# Altium schematic sheet [08] - LUX, LED_BOARD CONN.SchDoc
size A4; DocumentNumber: 8; SheetNumber: 8; SheetTotal: 14
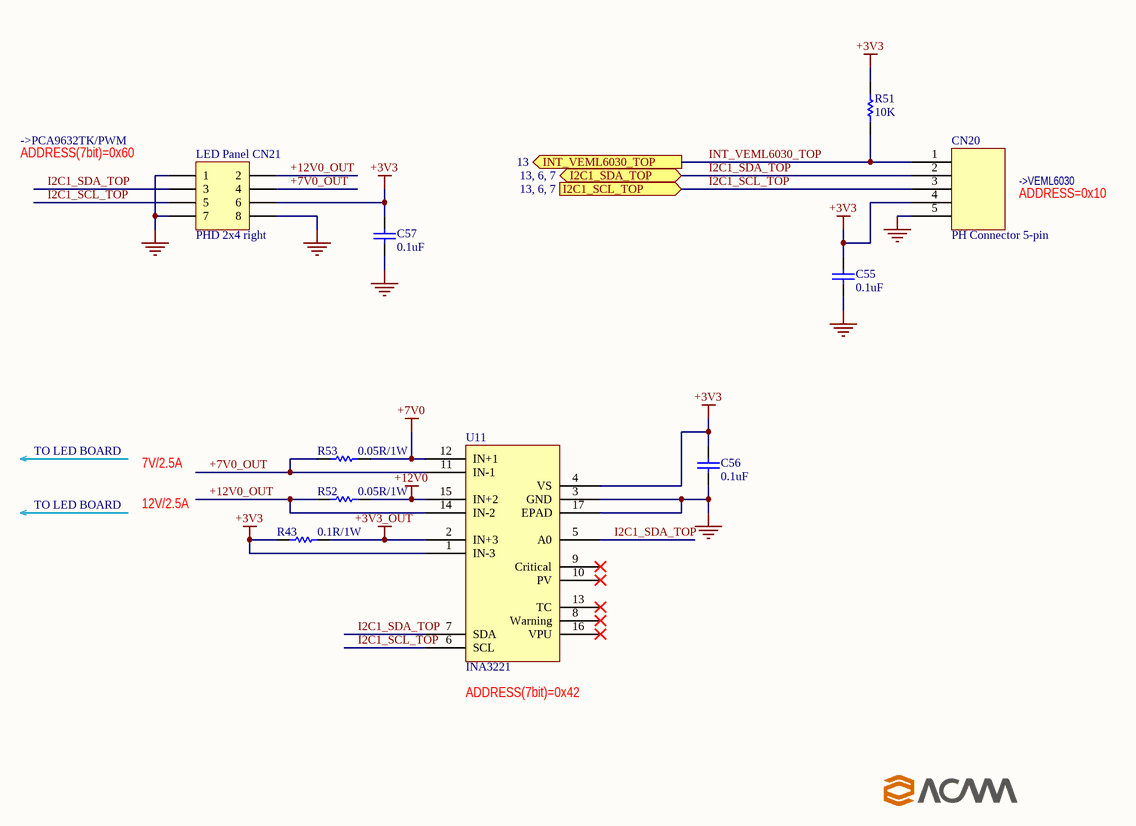
[diagram p0: [08] - LUX, LED_BOARD CONN.SchDoc]

## Parts
C55  0.1uF  [0805_C_AUTO]
C56  0.1uF  [0805_C_AUTO]
C57  0.1uF  [0805_C_AUTO]
CN20  PH Connector 5-pin  [PH_5PIN]
LED_Panel_CN21  PHD 2x4 right  [PHDR_8PIN]
R43  0.1R/1W  [2512_R]
R51  10K  [0805_R_AUTO]
R52  0.05R/1W  [2512_R]
R53  0.05R/1W  [2512_R]
U11  INA3221  [QFN-16]

## Ports
I2C1_SCL_TOP (in, see 13, 6, 7), I2C1_SDA_TOP (bidir, see 13, 6, 7), INT_VEML6030_TOP (out, see 13)

## Nets
+3V3: C55.2 C56.2 C57.2 CN20.4 LED_Panel_CN21.6 R43.1 R51.1 U11.1(IN-3) U11.4(VS)
+3V3_OUT: R43.2 U11.2(IN+3)
+7V0: R53.2 U11.12(IN+1)
+12V0: R52.2 U11.15(IN+2)
GND: C55.1 C56.1 C57.1 CN20.5 LED_Panel_CN21.1 LED_Panel_CN21.7 LED_Panel_CN21.8 U11.3(GND) U11.17(EPAD)
+7V0_OUT: LED_Panel_CN21.4 R53.1 U11.11(IN-1)
+12V0_OUT: LED_Panel_CN21.2 R52.1 U11.14(IN-2)
I2C1_SCL_TOP: CN20.3 LED_Panel_CN21.5 U11.6(SCL) ; port I2C1_SCL_TOP
I2C1_SDA_TOP: CN20.2 LED_Panel_CN21.3 U11.5(A0) U11.7(SDA) ; port I2C1_SDA_TOP
INT_VEML6030_TOP: CN20.1 R51.2 ; port INT_VEML6030_TOP

Not connected (* = marked no-connect by the designer): U11 8(Warning)* 9(Critical)* 10(PV)* 13(TC)* 16(VPU)*

## Notes on the sheet
- (near LED_Panel_CN21) ADDRESS(7bit)=0x60
- ->PCA9632TK/PWM
- ->VEML6030
- ADDRESS=0x10
- TO LED BOARD
- 12V/2.5A
- 7V/2.5A
- (near U11) ADDRESS(7bit)=0x42

## Library data of the parts
C55-C57 = Cap SMD: Non-Pol SMD Capacitor; RATED_VOLTAGE: 16V; Value: 0.1uF; Manufacturer Part Num: *
CN20 = PH Connector 5-pin: PH Connector , 5 pin, 2mm pitch, straight; Value: PH Connector 5-pin
LED_Panel_CN21 = PHD Connector 2x4 Right: S8B-PHDSS, PH Double Right 2x4; Value: PHD 2x4 right
R43 = Res SMD: SMD Resistor; Manufacturer Part Num: RL2512FK-070R1L; Tolerance: 1%; Value: 0.1R/1W
R51 = Res SMD: SMD Resistor; Tolerance: 5%; Value: 10K; Manufacturer Part Num: *
R52 R53 = Res SMD: SMD Resistor; Manufacturer Part Num: RL2512FK-070R05L; Tolerance: 1%; Value: 0.05R/1W
U11 = INA3221: INA3221 Triple-Channel, High-Side Measurement, / Shunt and Bus Voltage Monitor with I2C- and SMBUS-Compatible Interface; Manufacturer Part Num: INA3221AIRGVR; Value: INA3221